# Altium schematic sheet Trepanat_Sensors_1.SchDoc
size 594 x 420 mm; DocumentNumber: Введите номер платы + Э3; SheetNumber: номер страницы; Format: A2
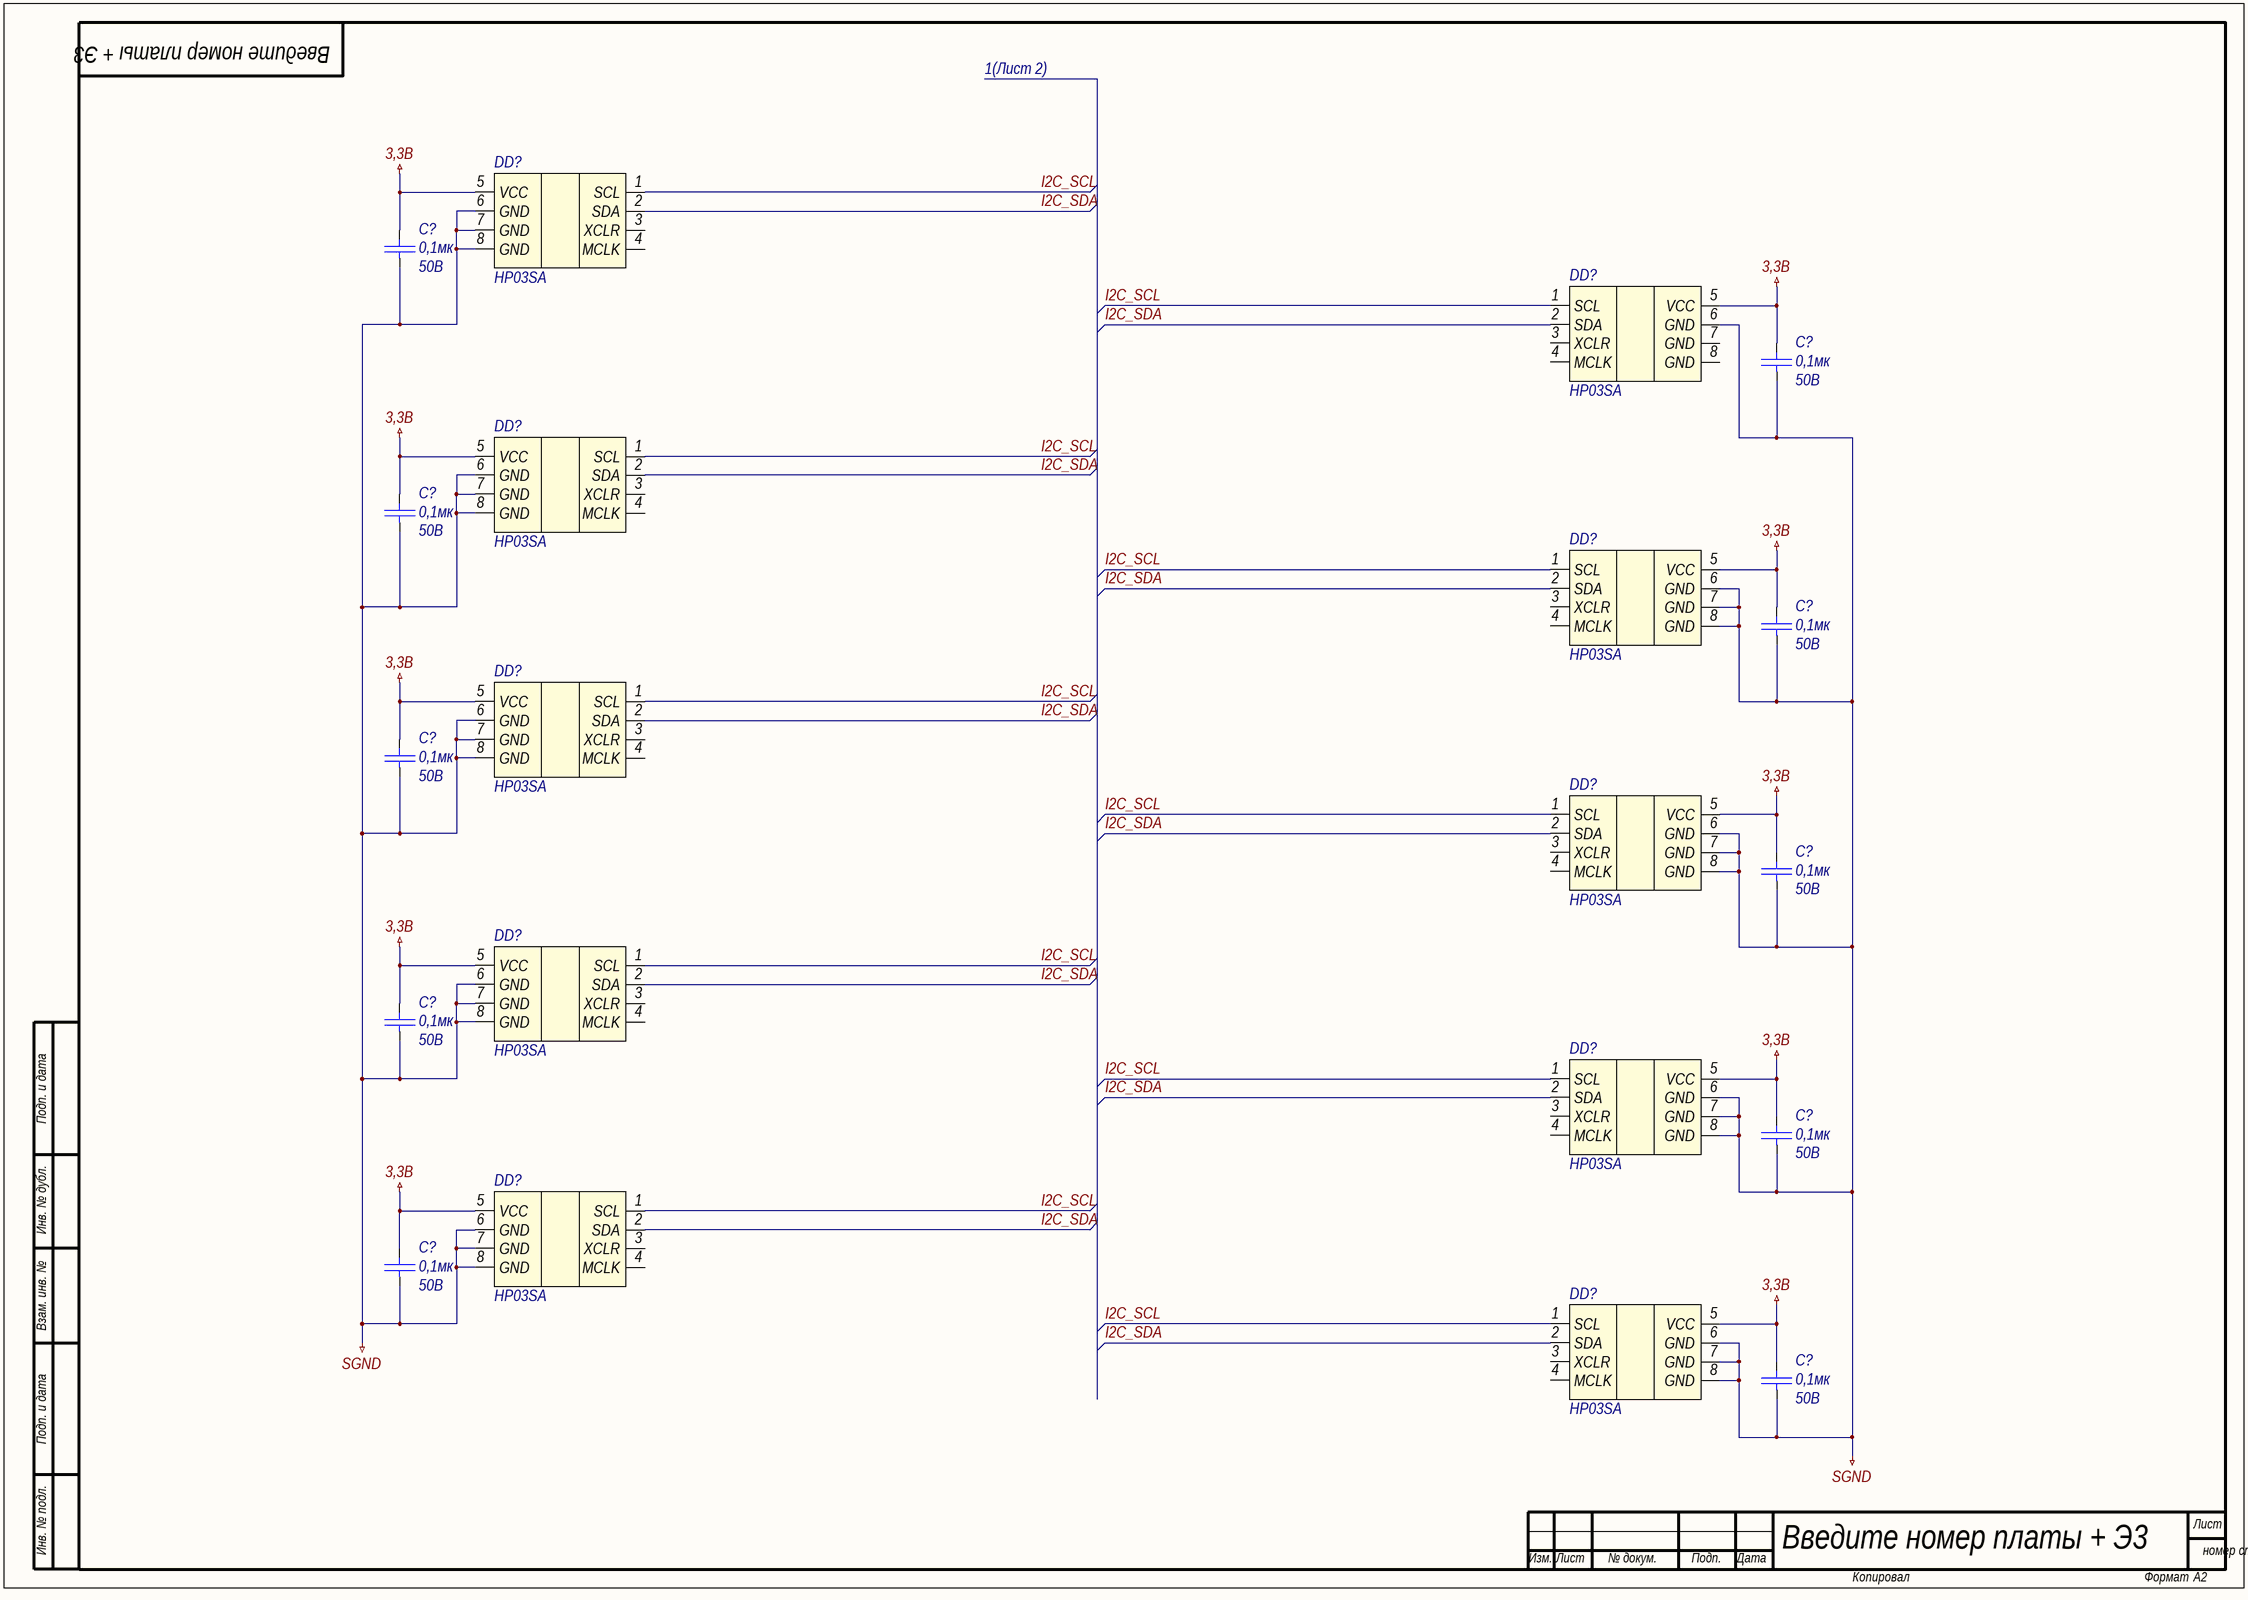
[diagram p0: Trepanat_Sensors_1.SchDoc]

## Parts
(Parts that share a designator on the sheet are numbered #1, #2 ... from top to bottom, then left to right.)
C?#1  0,1мк  Voltage: 50В  [C0805]
C?#2  0,1мк  Voltage: 50В  [C0805]
C?#3  0,1мк  Voltage: 50В  [C0805]
C?#4  0,1мк  Voltage: 50В  [C0805]
C?#5  0,1мк  Voltage: 50В  [C0805]
C?#6  0,1мк  Voltage: 50В  [C0805]
C?#7  0,1мк  Voltage: 50В  [C0805]
C?#8  0,1мк  Voltage: 50В  [C0805]
C?#9  0,1мк  Voltage: 50В  [C0805]
C?#10  0,1мк  Voltage: 50В  [C0805]
DD?#1  HP03SA  [HP03AS]
DD?#2  HP03SA  [HP03AS]
DD?#3  HP03SA  [HP03AS]
DD?#4  HP03SA  [HP03AS]
DD?#5  HP03SA  [HP03AS]
DD?#6  HP03SA  [HP03AS]
DD?#7  HP03SA  [HP03AS]
DD?#8  HP03SA  [HP03AS]
DD?#9  HP03SA  [HP03AS]
DD?#10  HP03SA  [HP03AS]

## Nets
3,3B: C?#1.2 C?#2.2 C?#3.2 C?#4.2 C?#5.2 C?#6.2 C?#7.2 C?#8.2 C?#9.2 C?#10.2 DD?#1.5(VCC) DD?#2.5(VCC) DD?#3.5(VCC) DD?#4.5(VCC) DD?#5.5(VCC) DD?#6.5(VCC) DD?#7.5(VCC) DD?#8.5(VCC) DD?#9.5(VCC) DD?#10.5(VCC)
SGND: C?#1.1 C?#2.1 C?#3.1 C?#4.1 C?#5.1 C?#6.1 C?#7.1 C?#8.1 C?#9.1 C?#10.1 DD?#1.6(GND) DD?#1.7(GND) DD?#1.8(GND) DD?#2.6(GND) DD?#3.6(GND) DD?#3.7(GND) DD?#3.8(GND) DD?#4.6(GND) DD?#4.7(GND) DD?#4.8(GND) DD?#5.6(GND) DD?#5.7(GND) DD?#5.8(GND) DD?#6.6(GND) DD?#6.7(GND) DD?#6.8(GND) DD?#7.6(GND) DD?#7.7(GND) DD?#7.8(GND) DD?#8.6(GND) DD?#8.7(GND) DD?#8.8(GND) DD?#9.6(GND) DD?#9.7(GND) DD?#9.8(GND) DD?#10.6(GND) DD?#10.7(GND) DD?#10.8(GND)
I2C_SCL: DD?#1.1(SCL) DD?#2.1(SCL) DD?#3.1(SCL) DD?#4.1(SCL) DD?#5.1(SCL) DD?#6.1(SCL) DD?#7.1(SCL) DD?#8.1(SCL) DD?#9.1(SCL) DD?#10.1(SCL)
I2C_SDA: DD?#1.2(SDA) DD?#2.2(SDA) DD?#3.2(SDA) DD?#4.2(SDA) DD?#5.2(SDA) DD?#6.2(SDA) DD?#7.2(SDA) DD?#8.2(SDA) DD?#9.2(SDA) DD?#10.2(SDA)

Not connected (* = marked no-connect by the designer): DD?#1 3(XCLR) 4(MCLK); DD?#2 3(XCLR) 4(MCLK) 7(GND) 8(GND); DD?#3 3(XCLR) 4(MCLK); DD?#4 3(XCLR) 4(MCLK); DD?#5 3(XCLR) 4(MCLK); DD?#6 3(XCLR) 4(MCLK); DD?#7 3(XCLR) 4(MCLK); DD?#8 3(XCLR) 4(MCLK); DD?#9 3(XCLR) 4(MCLK); DD?#10 3(XCLR) 4(MCLK)

## Notes on the sheet
- 1(Лист 2)
- Подп. и дата
- Инв. № дубл.
- Взам. инв. №
- Инв. № подл.
- Лист
- Изм.
- № докум.
- Подп.
- Дата
- Копировал
- Формат

## Library data of the parts
C?#1-C?#10 = Capacitor: Конденсатор; Value: 0,1мк
DD?#1-DD?#10 = HP03SA: Pressure module; Name: HP03SA